# EAGLE design circuit (EAGLE 9.6.2)
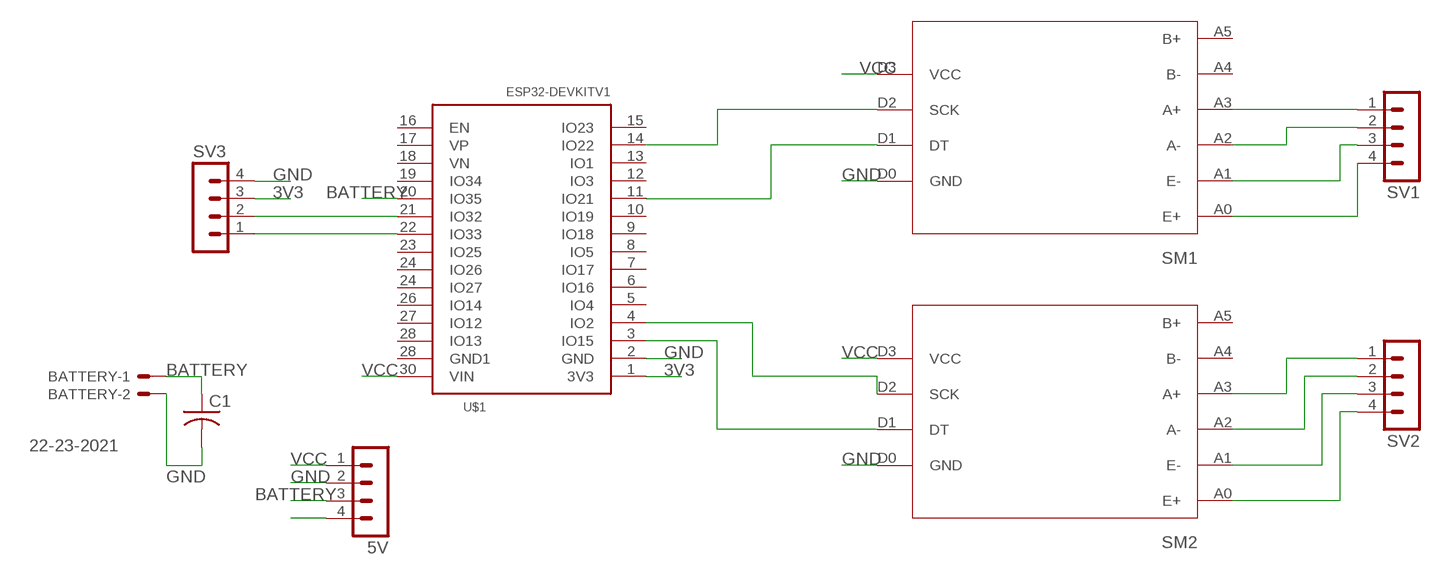
[diagram p0: schematic, sheet 1]

## Parts
5V  MA04-1  [MA04-1]
BATTERY  22-23-2021  [22-23-2021]
C1  C-US050-055X075  [C050-055X075]
SM1  HX711  [HX711]
SM2  HX711  [HX711]
SV1  MA04-1  [MA04-1]
SV2  MA04-1  [MA04-1]
SV3  MA04-1  [MA04-1]
U$1  ESP32DEVKITV1  [ESP32-DEVKITV1]

## Nets
3V3: SV3.3 U$1.1(3V3)
BATTERY: 5V.3 BATTERY.1 C1.1 U$1.20(IO35)
GND: 5V.2 BATTERY.2 C1.2 SM1.D0(GND) SM2.D0(GND) SV3.4 U$1.2(GND)
N$1: SM2.A0(E+) SV2.4
N$2: SM2.A1(E-) SV2.3
N$3: SM2.A2(A-) SV2.2
N$4: SM2.A3(A+) SV2.1
N$5: SM1.A0(E+) SV1.4
N$6: SM1.A1(E-) SV1.3
N$7: SM1.A2(A-) SV1.2
N$8: SM1.A3(A+) SV1.1
N$9: SM1.D2(SCK) U$1.14(IO22)
N$10: SM1.D1(DT) U$1.11(IO21)
N$12: SM2.D1(DT) U$1.3(IO15)
N$13: SM2.D2(SCK) U$1.4(IO2)
N$16: SV3.2 U$1.21(IO32)
N$17: SV3.1 U$1.22(IO33)
N$20: 5V.4
VCC: 5V.1 SM1.D3(VCC) SM2.D3(VCC) U$1.30(VIN)
Unconnected: SM1.A4(B-) SM1.A5(B+) SM2.A4(B-) SM2.A5(B+) U$1.5(IO4) U$1.6(IO16) U$1.7(IO17) U$1.8(IO5) U$1.9(IO18) U$1.10(IO19) U$1.12(IO3) U$1.13(IO1) U$1.15(IO23) U$1.16(EN) U$1.17(VP) U$1.18(VN) U$1.19(IO34) U$1.23(IO25) U$1.24(IO26) U$1.24(IO27) U$1.26(IO14) U$1.27(IO12) U$1.28(GND1) U$1.28(IO13)

## Library data of the parts
5V SV1-SV3 = con-lstb:MA04-1: PIN HEADER; OC_FARNELL: unknown; OC_NEWARK: unknown
BATTERY = con-molex:22-23-2021: .100" (2.54mm) Center Header - 2 Pin; MF: MOLEX; MPN: 22-23-2021; OC_FARNELL: 1462926; OC_NEWARK: 25C3832
C1 = rcl:C-US: CAPACITOR, American symbol; SPICEPREFIX: C
SM1 SM2 = hx711:HX711: HX711 module is a Load Cell Amplifier breakout board for the HX711 IC that allows you to easily read load cells to measure weight. This module uses 24 high precision A/D converter chip HX711. It is a specially designed for the high precision electronic scale design, with two analog input channel, the internal integration of 128 times the programmable gain amplifier. The input circuit can be configured to provide a bridge type pressure bridge (such as pressure, weighing sensor mode), is of high precision, low cost is an ideal sampling front-end module.
U$1 = ESP32-DEVKITV1:ESP32DEVKITV1

## Board
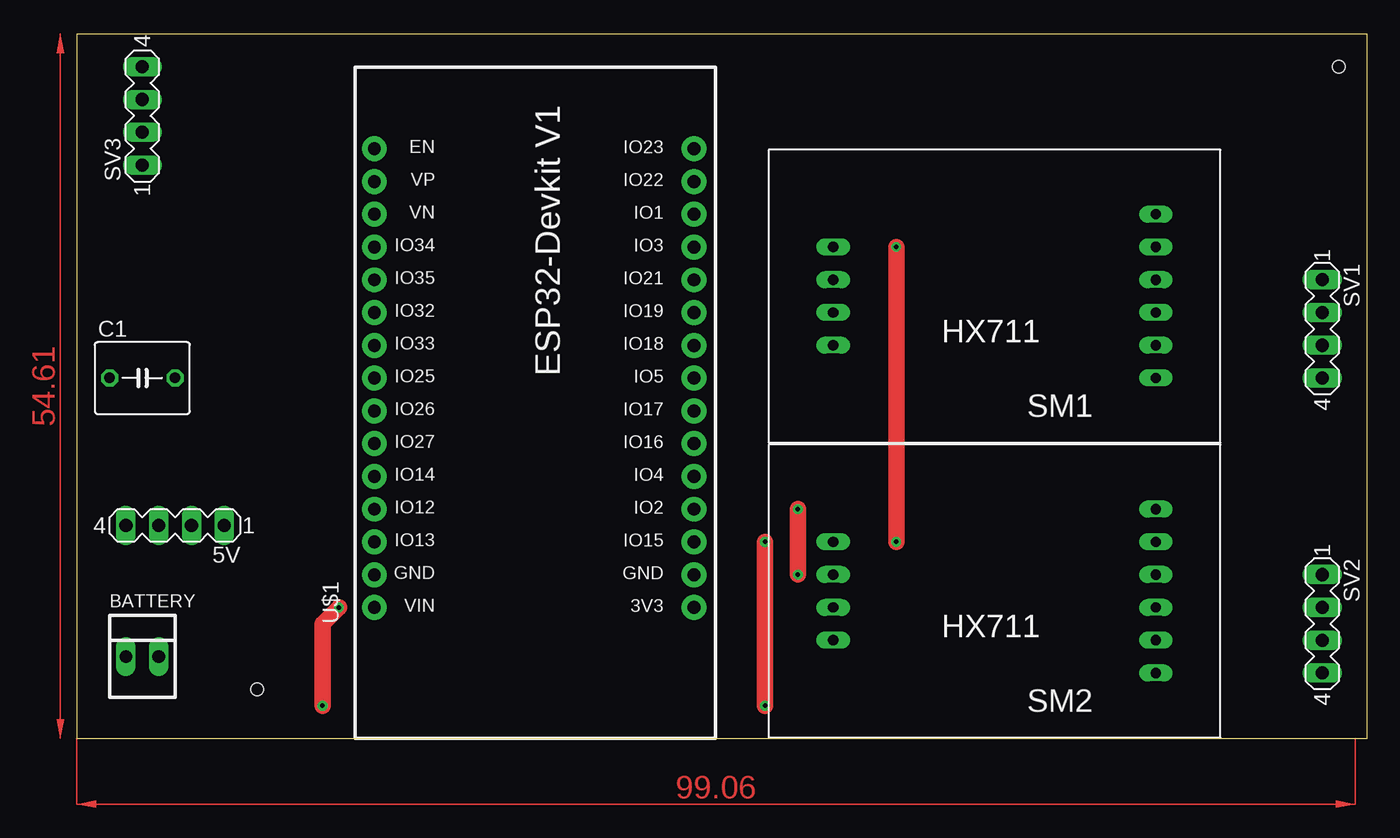
[diagram p1: board, top side]
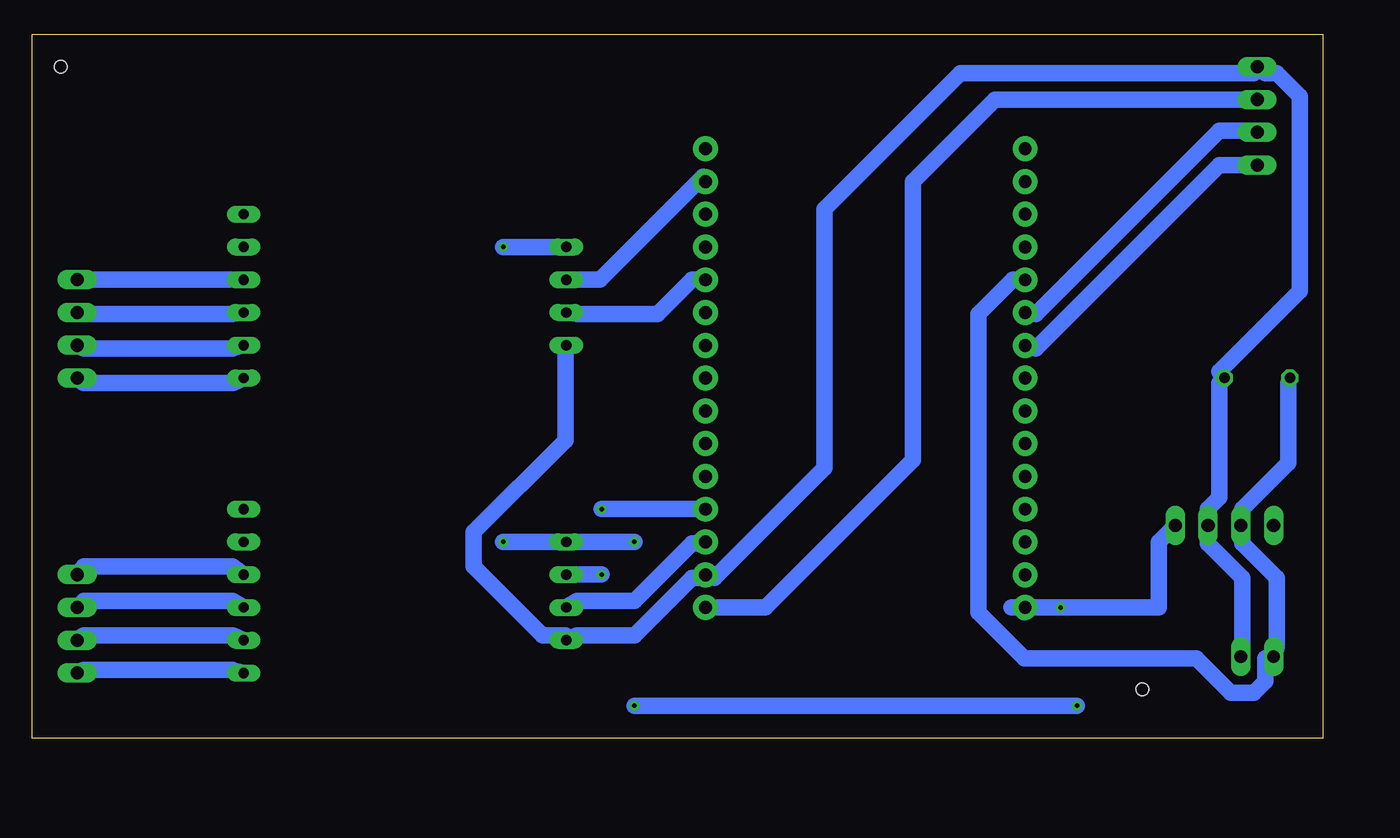
[diagram p2: board, bottom side, seen from below]

Size 100 x 54.6 mm. Coordinates in mm from the lower left corner, seen from the top.
Outline: 0,0 100,0 100,54.6 0,54.6 0,0
Copper layers (1*16): Top 0.2mm / dielectric 1.5mm / Bottom 0.2mm
Design rules "default *": minimum track width 50mil, minimum drill 0.35mm, track to track 20mil, track to pad 20mil, pad to pad 20mil, via to via 20mil, smd to smd 6mil, copper to edge 40mil, drill to drill 6mil, minimum pad ring 10mil, minimum via ring 8mil, stop-mask expansion 4mil, vias tented up to drill 0mil, thermal gap 10mil
Holes 1 mm at 13.97,3.81 97.79,52.07

### Footprints (pad centres in the part's own frame; a part is rotated, then mirrored left to right if it is on the bottom)
MA04-1 = drill 1.016 long: 1 -3.81,0; 2 -1.27,0; 3 1.27,0; 4 3.81,0
22-23-2021 = drill 1 long: 1 -1.27,0; 2 1.27,0
C050-055X075 = drill 0.813 octagon: 1 -2.54,0; 2 2.54,0
HX711 = drill 0.8 long: A0 -12.5,6.35; A1 -12.5,3.81; A2 -12.5,1.27; A3 -12.5,-1.27; A4 -12.5,-3.81; A5 -12.5,-6.35; D0 12.5,3.81; D1 12.5,1.27; D2 12.5,-1.27; D3 12.5,-3.81
ESP32-DEVKITV1 = drill 1 pad 1.93: 1 -22.87,-13.54; 2 -20.33,-13.54; 3 -17.79,-13.54; 4 -15.25,-13.54; 5 -12.71,-13.54; 6 -10.17,-13.54; 7 -7.63,-13.54; 8 -5.09,-13.54; 9 -2.55,-13.54; 10 -0.01,-13.54; 11 2.53,-13.54; 12 5.07,-13.54; 13 7.61,-13.54; 14 10.15,-13.54; 15 12.69,-13.54; 16 12.69,11.23; 17 10.15,11.23; 18 7.61,11.23; 19 5.07,11.23; 20 2.53,11.23; 21 -0.01,11.23; 22 -2.55,11.23; 23 -5.09,11.23; 24 -7.63,11.23; 25 -10.17,11.23; 26 -12.71,11.23; 27 -15.25,11.23; 28 -17.79,11.23; 29 -20.33,11.23; 30 -22.87,11.23

### Placement (x,y rotation side)
5V  7.62,16.51 180 top
BATTERY  5.08,6.35 0 top
C1  5.08,27.94 0 top
SM1  71.12,34.29 180 top
SM2  71.12,11.43 180 top
SV1  96.52,31.75 270 top
SV2  96.52,8.89 270 top
SV3  5.08,48.26 90 top
U$1  34.29,33.02 90 top

### Tracks (layer width: path | path; a pad name or v marks a point on that pad's centre or on a via)
3V3
  Bottom 1.27: U$1.1 43.19,10.15 31.75,21.59 31.75,43.18 25.4,49.53 SV3.3
BATTERY
  Bottom 1.27: C1.1 2.67,27.56 2.67,21.34 6.22,17.78 6.22,16.89 5V.3 6.22,16 6.22,15.11 3.56,12.45 3.56,7.11 BATTERY.1 4.45,6.22 4.45,4.45 5.33,3.56 7.11,3.56 9.78,6.22 23.11,6.22 26.67,9.78 26.67,32.89 24,35.56 23.11,35.56 U$1.20
GND
  Bottom 1.27: SM1.D0 58.67,30.23 58.67,23.11 65.79,16 65.79,13.34 60.45,8 58.67,8 SM2.D0 57.78,8 53.34,8 48.9,12.45 48.01,12.45 U$1.2 47.12,12.45 38.61,20.95 38.61,41.02 28.07,51.56 5.33,51.56 SV3.4 4.45,51.56 3.56,51.56 1.78,49.78 1.78,34.67 8,28.45 C1.2 8,27.56 8,18.67 8.89,17.78 5V.2 8.89,15.11 6.22,12.45 6.22,7.11 BATTERY.2
N$1
  Bottom 1.27: SM2.A0 84.45,5.33 96.01,5.33 SV2.4
N$2
  Bottom 1.27: SM2.A1 84.45,8 96.01,8 SV2.3
N$3
  Bottom 1.27: SM2.A2 84.45,10.67 96.01,10.67 SV2.2
N$4
  Bottom 1.27: SM2.A3 84.45,13.34 96.01,13.34 SV2.1
N$5
  Bottom 1.27: SM1.A0 84.45,27.56 96.01,27.56 SV1.4
N$6
  Bottom 1.27: SM1.A1 84.45,30.23 96.01,30.23 SV1.3
N$7
  Bottom 1.27: SM1.A2 84.45,32.89 96.01,32.89 SV1.2
N$8
  Bottom 1.27: SV1.1 SM1.A3
N$9
  Bottom 1.27: SM1.D2 56.01,35.56 48.01,43.56 U$1.14
N$10
  Bottom 1.27: SM1.D1 57.78,32.89 51.56,32.89 48.9,35.56 48.01,35.56 U$1.11
N$12
  Bottom 1.27: SM2.D1 57.78,10.67 53.34,10.67 48.9,15.11 48.01,15.11 U$1.3
N$13  (via drill 0.35)
  Top 1.27: v55.88,12.7 v55.88,17.78
  Bottom 1.27: SM2.D2 v55.88,12.7 | U$1.4 v55.88,17.78
N$16
  Bottom 1.27: SV3.2 5.33,47.12 8,47.12 22.23,32.89 U$1.21
N$17
  Bottom 1.27: SV3.1 8,44.45 22.23,30.23 U$1.22
VCC  (via drill 0.35)
  Top 1.27: v63.5,38.1 v63.5,15.24 | v53.34,15.24 v53.34,2.54 | v19.05,2.54 19.05,8.89 v20.32,10.16
  Bottom 1.27: 5V.1 12.7,15.24 12.7,10.16 v20.32,10.16 23.11,10.16 | 23.11,10.16 24.13,10.16 | SM1.D3 v63.5,38.1 | v63.5,15.24 SM2.D3 v53.34,15.24 | v53.34,2.54 v19.05,2.54 | U$1.30 23.11,9.78 23.11,10.16
(copper drawn outside any net)
  shapes: Top area x2